# Altium schematic sheet 301_FrameUSB.SchDoc: USB Framework Ports
size A2; Organization: Greenfield Tech Solutions; Address1: Molendreef 33; Address2: Ossendrecht; Address3: 4641CS; Address4: The Netherlands; SheetNumber: 4; SheetTotal: 8
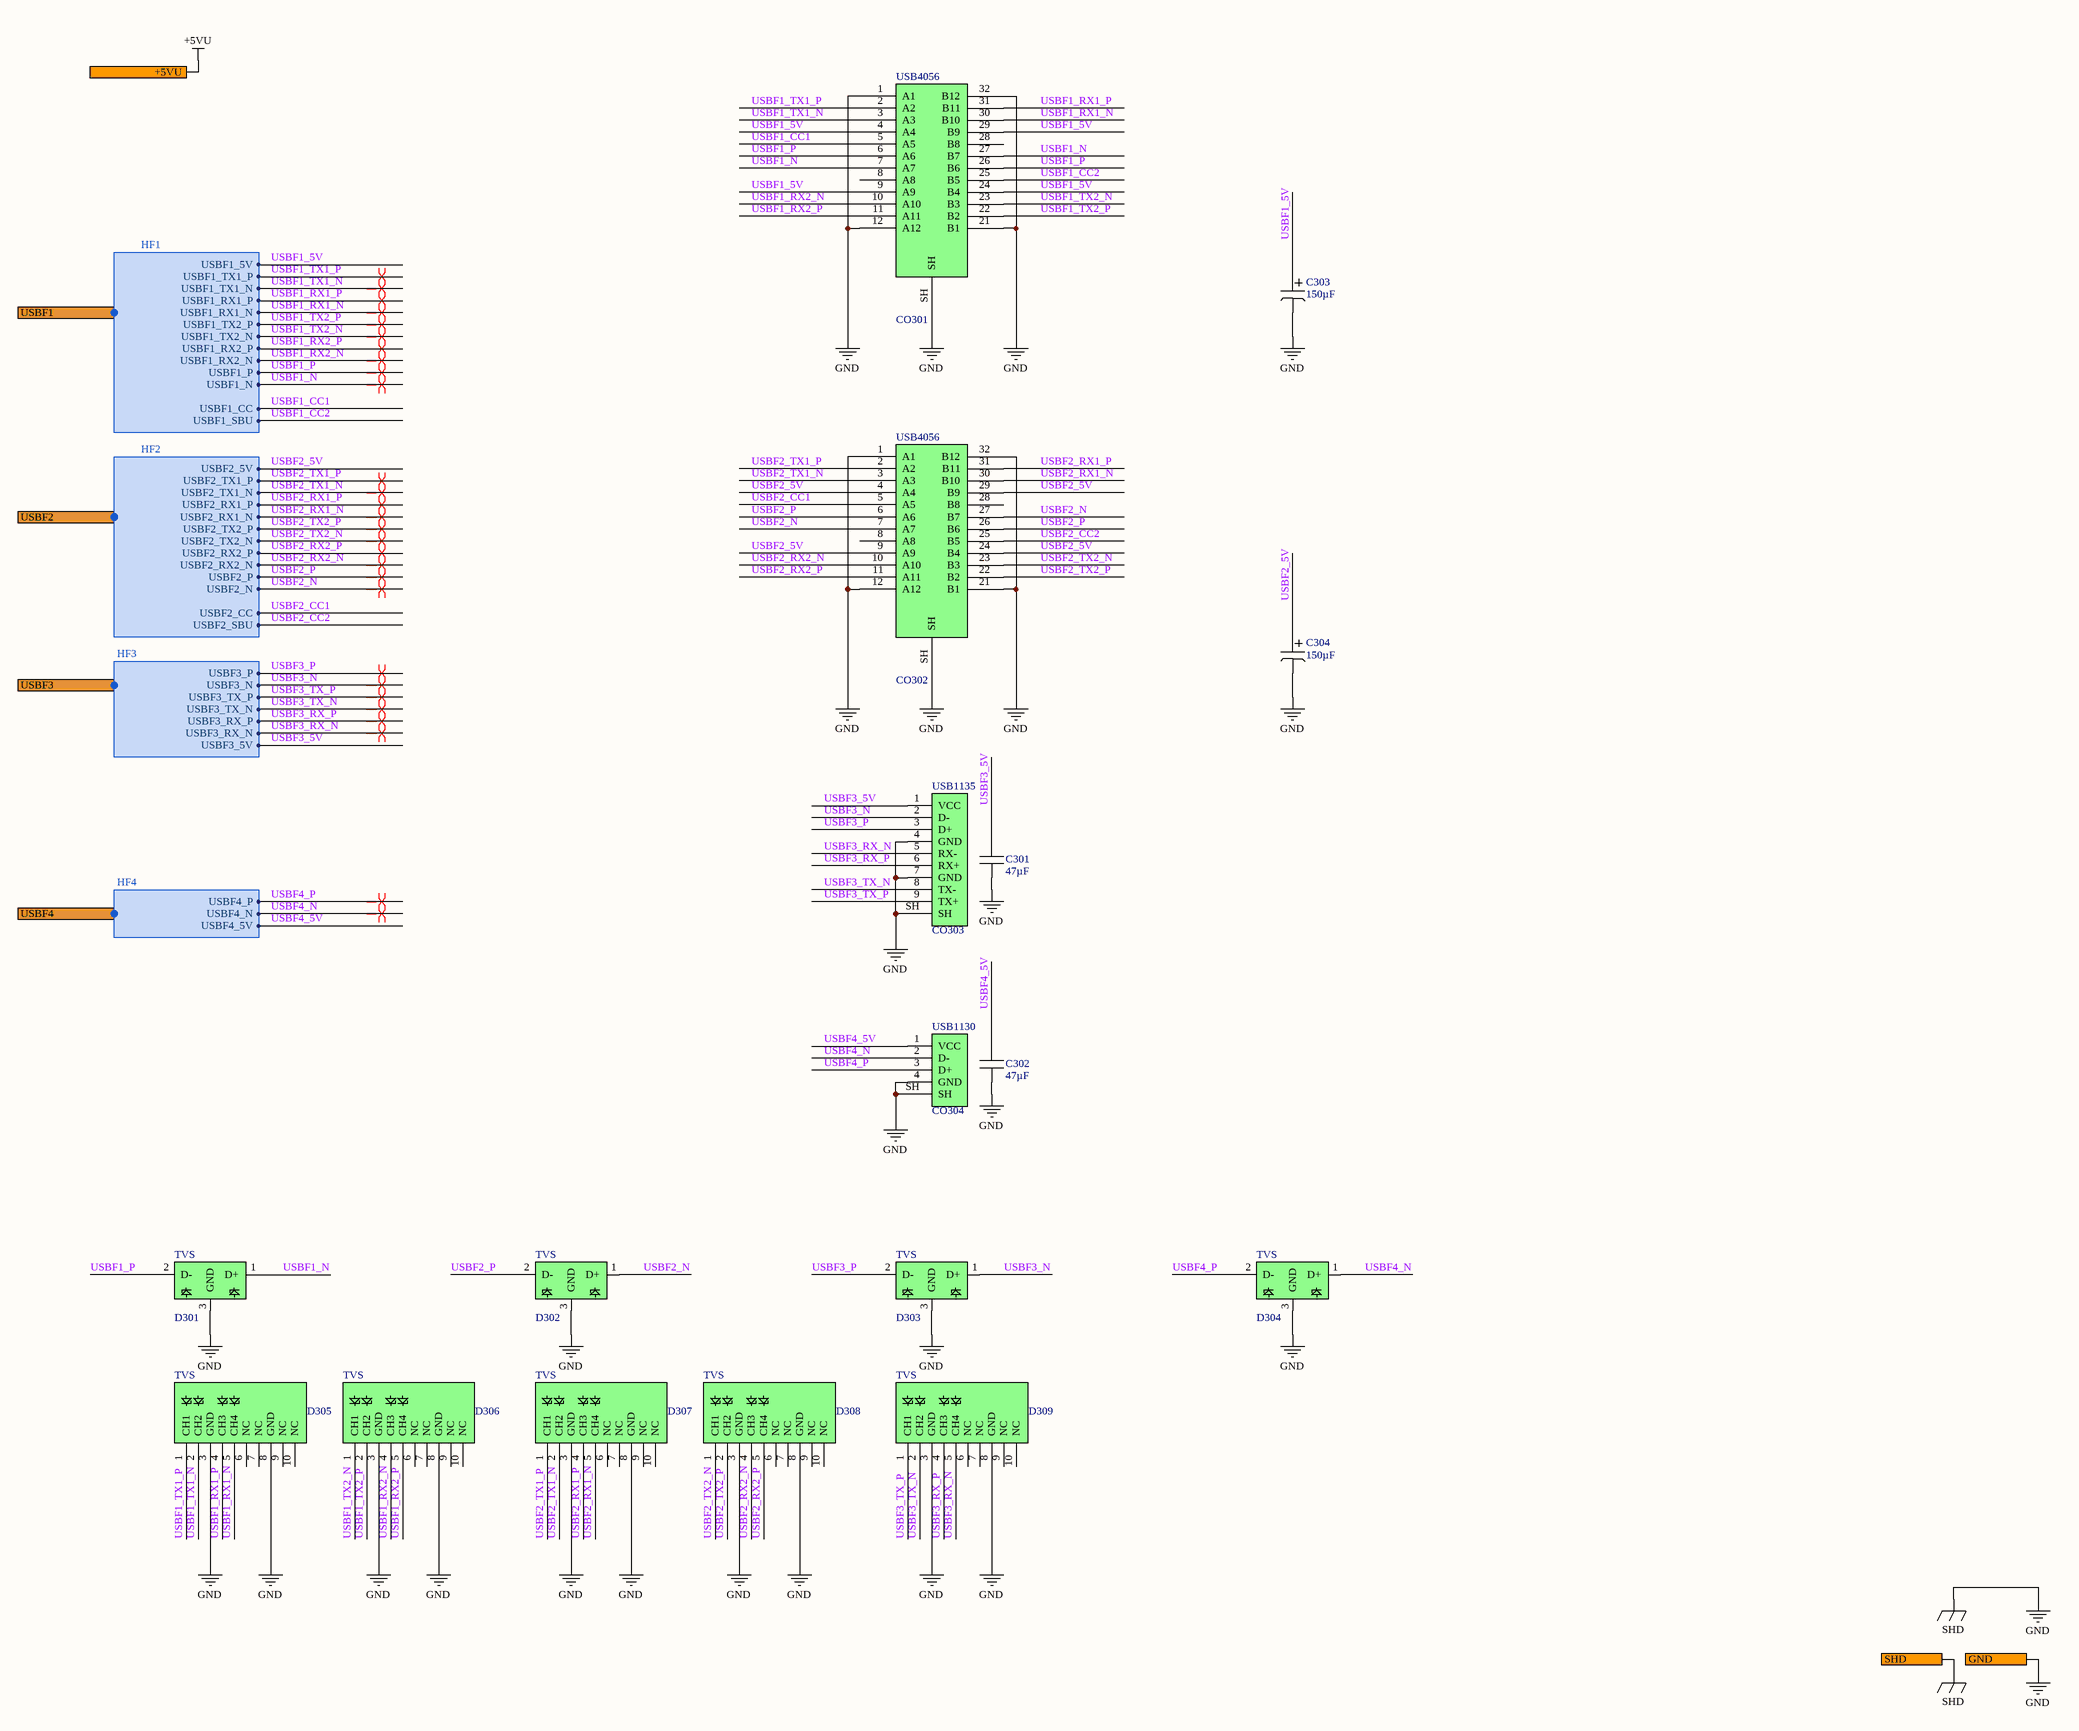
[diagram p0: 301_FrameUSB.SchDoc]

## Parts
C301  47µF  [C1210]
C302  47µF  [C1210]
C303  150µF  [RL_10_5_12.5]
C304  150µF  [RL_10_5_12.5]
CO301  USB4056  [USB4056-03-A]
CO302  USB4056  [USB4056-03-A]
CO303  USB1135  [USB1135-15-9-L-B]
CO304  USB1130  [USB1130-15-A]
D301  TVS  [SOT-3]
D302  TVS  [SOT-3]
D303  TVS  [SOT-3]
D304  TVS  [SOT-3]
D305  TVS  [SOT-1176-1]
D306  TVS  [SOT-1176-1]
D307  TVS  [SOT-1176-1]
D308  TVS  [SOT-1176-1]
D309  TVS  [SOT-1176-1]

## Ports
+5VU, GND, SHD, USBF1 (harness HF1), USBF2 (harness HF2), USBF3 (harness HF3), USBF4 (harness HF4)

## Harnesses
HF1: USBF1_5V, USBF1_TX1_P, USBF1_TX1_N, USBF1_RX1_P, USBF1_RX1_N, USBF1_CC, USBF1_SBU, USBF1_RX2_P, USBF1_RX2_N, USBF1_TX2_P, USBF1_TX2_N, USBF1_N, USBF1_P
HF2: USBF2_5V, USBF2_TX1_P, USBF2_TX1_N, USBF2_RX1_P, USBF2_RX1_N, USBF2_CC, USBF2_SBU, USBF2_RX2_P, USBF2_RX2_N, USBF2_TX2_P, USBF2_TX2_N, USBF2_N, USBF2_P
HF3: USBF3_N, USBF3_P, USBF3_TX_N, USBF3_TX_P, USBF3_RX_N, USBF3_RX_P, USBF3_5V
HF4: USBF4_N, USBF4_P, USBF4_5V

## Nets
+5VU: port +5VU
GND: C301.2 C302.2 C303.2 C304.2 CO301.1(A1) CO301.12(A12) CO301.21(B1) CO301.32(B12) CO301.SH CO302.1(A1) CO302.12(A12) CO302.21(B1) CO302.32(B12) CO302.SH CO303.4(GND) CO303.7(GND) CO303.SH CO304.4(GND) CO304.SH D301.3(GND) D302.3(GND) D303.3(GND) D304.3(GND) D305.3(GND) D305.8(GND) D306.3(GND) D306.8(GND) D307.3(GND) D307.8(GND) D308.3(GND) D308.8(GND) D309.3(GND) D309.8(GND) ; port GND, port SHD  [also labelled SHD]
USBF1_5V: C303.1 CO301.4(A4) CO301.9(A9) CO301.24(B4) CO301.29(B9) ; port USBF1.USBF1_5V
USBF1_CC1: CO301.5(A5) ; port USBF1.USBF1_CC
USBF1_CC2: CO301.25(B5) ; port USBF1.USBF1_SBU
USBF1_N: CO301.7(A7) CO301.27(B7) D301.1(D+) ; port USBF1.USBF1_N
USBF1_P: CO301.6(A6) CO301.26(B6) D301.2(D-) ; port USBF1.USBF1_P
USBF1_RX1_N: CO301.30(B10) D305.5(CH4) ; port USBF1.USBF1_RX1_N
USBF1_RX1_P: CO301.31(B11) D305.4(CH3) ; port USBF1.USBF1_RX1_P
USBF1_RX2_N: CO301.10(A10) D306.4(CH3) ; port USBF1.USBF1_RX2_N
USBF1_RX2_P: CO301.11(A11) D306.5(CH4) ; port USBF1.USBF1_RX2_P
USBF1_TX1_N: CO301.3(A3) D305.2(CH2) ; port USBF1.USBF1_TX1_N
USBF1_TX1_P: CO301.2(A2) D305.1(CH1) ; port USBF1.USBF1_TX1_P
USBF1_TX2_N: CO301.23(B3) D306.1(CH1) ; port USBF1.USBF1_TX2_N
USBF1_TX2_P: CO301.22(B2) D306.2(CH2) ; port USBF1.USBF1_TX2_P
USBF2_5V: C304.1 CO302.4(A4) CO302.9(A9) CO302.24(B4) CO302.29(B9) ; port USBF2.USBF2_5V
USBF2_CC1: CO302.5(A5) ; port USBF2.USBF2_CC
USBF2_CC2: CO302.25(B5) ; port USBF2.USBF2_SBU
USBF2_N: CO302.7(A7) CO302.27(B7) D302.1(D+) ; port USBF2.USBF2_N
USBF2_P: CO302.6(A6) CO302.26(B6) D302.2(D-) ; port USBF2.USBF2_P
USBF2_RX1_N: CO302.30(B10) D307.5(CH4) ; port USBF2.USBF2_RX1_N
USBF2_RX1_P: CO302.31(B11) D307.4(CH3) ; port USBF2.USBF2_RX1_P
USBF2_RX2_N: CO302.10(A10) D308.4(CH3) ; port USBF2.USBF2_RX2_N
USBF2_RX2_P: CO302.11(A11) D308.5(CH4) ; port USBF2.USBF2_RX2_P
USBF2_TX1_N: CO302.3(A3) D307.2(CH2) ; port USBF2.USBF2_TX1_N
USBF2_TX1_P: CO302.2(A2) D307.1(CH1) ; port USBF2.USBF2_TX1_P
USBF2_TX2_N: CO302.23(B3) D308.1(CH1) ; port USBF2.USBF2_TX2_N
USBF2_TX2_P: CO302.22(B2) D308.2(CH2) ; port USBF2.USBF2_TX2_P
USBF3_5V: C301.1 CO303.1(VCC) ; port USBF3.USBF3_5V
USBF3_N: CO303.2(D-) D303.1(D+) ; port USBF3.USBF3_N
USBF3_P: CO303.3(D+) D303.2(D-) ; port USBF3.USBF3_P
USBF3_RX_N: CO303.5(RX-) D309.5(CH4) ; port USBF3.USBF3_RX_N
USBF3_RX_P: CO303.6(RX+) D309.4(CH3) ; port USBF3.USBF3_RX_P
USBF3_TX_N: CO303.8(TX-) D309.2(CH2) ; port USBF3.USBF3_TX_N
USBF3_TX_P: CO303.9(TX+) D309.1(CH1) ; port USBF3.USBF3_TX_P
USBF4_5V: C302.1 CO304.1(VCC) ; port USBF4.USBF4_5V
USBF4_N: CO304.2(D-) D304.1(D+) ; port USBF4.USBF4_N
USBF4_P: CO304.3(D+) D304.2(D-) ; port USBF4.USBF4_P

Not connected (* = marked no-connect by the designer): CO301 8(A8) 28(B8); CO302 8(A8) 28(B8); D305 6(NC) 7(NC) 9(NC) 10(NC); D306 6(NC) 7(NC) 9(NC) 10(NC); D307 6(NC) 7(NC) 9(NC) 10(NC); D308 6(NC) 7(NC) 9(NC) 10(NC); D309 6(NC) 7(NC) 9(NC) 10(NC)

## Layout directives
differential pair; differential pair class USB3: USBF1_N, USBF1_P, USBF1_RX1_N, USBF1_RX1_P, USBF1_RX2_N, USBF1_RX2_P, USBF1_TX1_N, USBF1_TX1_P, USBF1_TX2_N, USBF1_TX2_P, USBF2_N, USBF2_P, USBF2_RX1_N, USBF2_RX1_P, USBF2_RX2_N, USBF2_RX2_P, USBF2_TX1_N, USBF2_TX1_P, USBF2_TX2_N, USBF2_TX2_P, USBF3_N, USBF3_P, USBF3_RX_N, USBF3_RX_P, USBF3_TX_N, USBF3_TX_P, USBF4_N, USBF4_P

## Notes on the sheet
- Title
- Size:
- Date:
- File:
- A2
- Number:
- Time:
- Revision:
- Sheet
- of

## Library data of the parts
C301 C302 = CA0007: 47µF 16V 20% X5R; Part Number: CA0007; ManfactPart: EMK325ABJ476MM8P; ID: 7; RefVal: 47µF
C303 C304 = CA0043: 150µF 50V 20% 363mA; Part Number: CA0043; ManfactPart: 860010675016; ID: 43; RefVal: 150µF
CO301 CO302 = CO0030: USB C connector Receptacle Horizontal; Part Number: CO0030; ID: 29; RefVal: USB4056; ManfactPart: USB4056-03-A
CO303 = CO0041: USB3.0 Type A receptacle Horizontal; Part Number: CO0041; ID: 41; RefVal: USB1135; ManfactPart: USB1135-15-9-L-B
CO304 = CO0040: USB2.0 Type A receptacle Horizontal; Part Number: CO0040; ID: 40; RefVal: USB1130; ManfactPart: USB1130-15-A
D301-D304 = DI0002: USB 2 TVS Diode; Part Number: DI0002; ManfactPart: TPD2EUSB30DRTR; ID: 2; RefVal: TVS
D305-D309 = DI0007: USB 3 TVS Diode; Part Number: DI0007; ManfactPart: PUSB3FA2Z; ID: 7; RefVal: TVS